# Altium schematic sheet rs485.SchDoc
size 330 x 190 mm; SheetNumber: 2; SheetTotal: 3
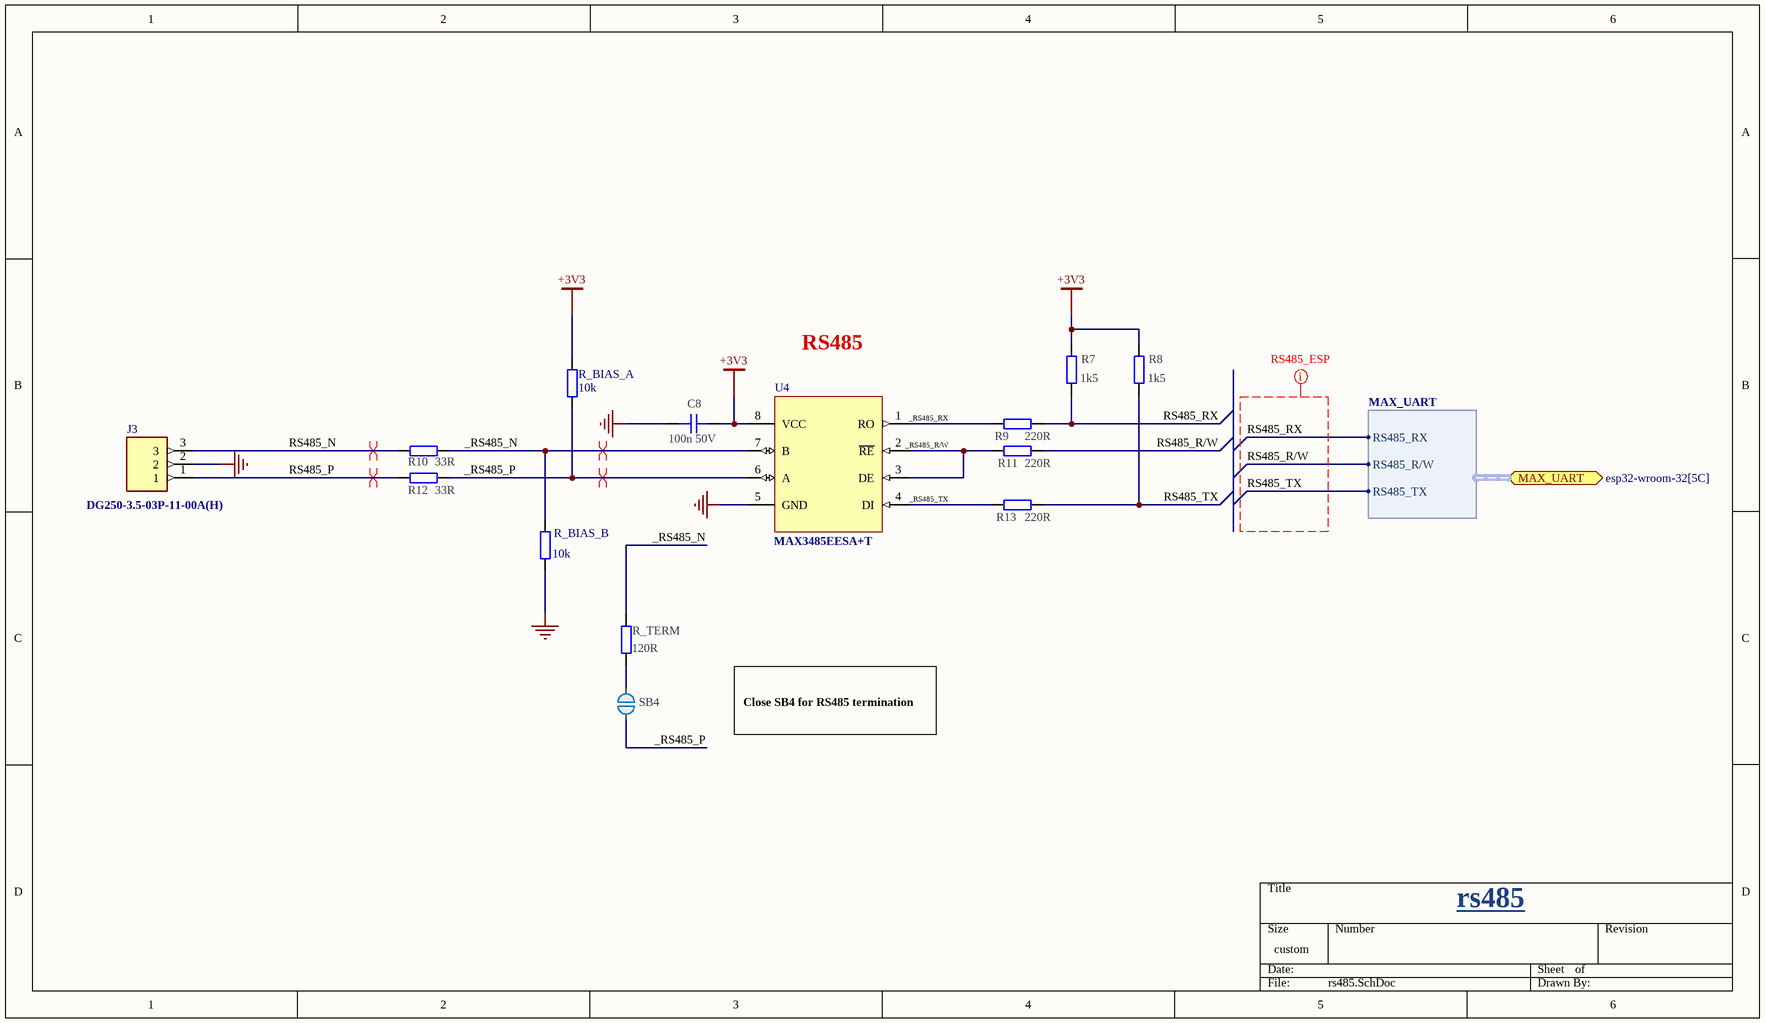
[diagram p0: rs485.SchDoc]

## Parts
C8  100n 50V  [CAPC1005X04L]
J3  DG250-3.5-03P-11-00A(H)  [DG250-3.5-03P-11-00AH]
R7  1k5  [RESC1005X04L]
R8  1k5  [RESC1005X04L]
R9  220R  [RESC1005X04L]
R10  33R  [RESC1005X04L]
R11  220R  [RESC1005X04L]
R12  33R  [RESC1005X04L]
R13  220R  [RESC1005X04L]
R_BIAS_A  10k  [RES_0603]
R_BIAS_B  10k  [RES_0603]
R_TERM  120R  [RESC1005X04L]
SB4  Solderbridge  [Solderbridge]  (value not drawn)  (no BOM)
U4  MAX3485EESA+T  [SOIC127P600X175-8N]

## Ports
MAX_UART (bidir, harness MAX_UART, see esp32-wroom-32[5C])

## Harnesses
MAX_UART: RS485_RX, RS485_R/W, RS485_TX

## Nets
+3V3: C8.2 R7.1 R8.1 R_BIAS_A.2 U4.8(VCC)
GND: C8.1 J3.2 R_BIAS_B.1 U4.5(GND)
_RS485_N: R10.2 R_BIAS_B.2 R_TERM.2 U4.7(B)
_RS485_P: R12.2 R_BIAS_A.1 SB4.2 U4.6(A)
_RS485_R/W: R11.1 U4.2(~{RE}) U4.3(DE)
_RS485_RX: R9.1 U4.1(RO)
_RS485_TX: R13.1 U4.4(DI)
RS485_N: J3.3 R10.1
RS485_P: J3.1 R12.1
RS485_R/W: R11.2 ; port MAX_UART.RS485_R/W
RS485_RX: R7.2 R9.2 ; port MAX_UART.RS485_RX
RS485_TX: R8.2 R13.2 ; port MAX_UART.RS485_TX
NetR_TERM_1: R_TERM.1 SB4.1

## Layout directives
differential pair: _RS485_N, _RS485_P, RS485_N, RS485_P
mark named RS485_ESP: RS485_R/W, RS485_RX, RS485_TX

## Notes on the sheet
- RS485
- Close SB4 for RS485 termination
- rs485

## Library data of the parts
C8 = C0402-4µ7: Capacitor, X5R, ±20%; Manufacturer: N.A.; Part number IPS: 00000001251, 00000007165; Part number NEMS: 100200193; Value: 4.7µF; Note: 10V; Artikkelnr Noca: 20039482; Pad Count: 2; Component Status: Active; Part Number: C0402-4µ7; Manufacturer Part Number: N.A.; ComponentLink1URL: N.A.; ComponentLink1Description: Datasheet; ComponentLink2URL: N.A.; ComponentLink2Description: Supplier link; HelpURL: N.A.; Footprint Doc: 0402; LatestRevisionDate: 2017-11-09; Published: 2009-05-08; Supplier 1: Digi-Key; Supplier Part Number 1: 490-13252-1-ND; Supplier 2: N.A.; Supplier Part Number 2: N.A.; PartId: 100200193; Component Class: Capacitors; Author: rsk; Part number Norautron: N.A.
J3 = DG250-3.5-03P-11-00A(H): Terminal block; 3.5mm; with push button; angled 45Â°; ways: 3; 5A; MF: Degson; SnapEDA_Link: https://www.snapeda.com/parts/DG250-3.5-03P-11-00A(H)/Degson/view-part/?ref=snap; Package: None; Value: *; MP: DG250-3.5-03P-11-00A(H); Check_prices: https://www.snapeda.com/parts/DG250-3.5-03P-11-00A(H)/Degson/view-part/?ref=eda
R7-R13 R_TERM = R0402-0R: Resistor, ±5%, 0.063W; Manufacturer: N.A.; Part number IPS: 00000007128; Part number NEMS: 100100109; Value: 0R; Note: Chip Res 5%; Artikkelnr Noca: 27049000; Pad Count: 2; Component Status: Active; Part Number: R0402-0R; Manufacturer Part Number: N.A.; ComponentLink1URL: N.A.; ComponentLink1Description: Datasheet; ComponentLink2URL: N.A.; ComponentLink2Description: Supplier link; HelpURL: N.A.; Footprint Doc: 0402; LatestRevisionDate: 2009-11-23; Published: 2009-05-08; Supplier 1: Farnell; Supplier Part Number 1: 146-9661; Supplier 2: N.A.; Supplier Part Number 2: N.A.; PartId: 100100109; Component Class: Resistors; Author: rsk; Part number Norautron: N.A.
R_BIAS_A R_BIAS_B = RES_0603: Resistor SMD 0603; Manufacturer: *; Manufacturer Part Number: *; Distributor Link: *; LCSC: *
SB4 = Solderbridge: Manufacturer: N.A.; Part number NEMS: 100500458; Pad Count: 2; Component Status: Active; System: Connector; Part Number: Solderbridge; Manufacturer Part Number: N.A.; LatestRevisionDate: 2009-12-14; Published: 2009-12-14; Value: Solderbridge; Note: N.A.; Artikkelnr Noca: N.A.; Footprint Doc: Solderbridge; Part number IPS: N.A.; ComponentLink1URL: N.A.; ComponentLink1Description: Datasheet; ComponentLink2URL: N.A.; ComponentLink2Description: Supplier link; HelpURL: N.A.; Supplier 1: N.A.; Supplier Part Number 1: N.A.; Supplier 2: N.A.; Supplier Part Number 2: N.A.; PartId: 100500458; Component Class: Connectors; Author: rsk; Part number Norautron: N.A.
U4 = MAX3485EESA+T: 3.3V Powered, Â±15kV ESD-Protected, 12Mbps, Slew-Rate-Limited True RS-485/RS-422 Transceivers3.3V ä¾›ç”µã€Â±15kV ESD ä¿æŠ¤ã€12Mbpsã€åŽ‹æ‘†çŽ‡å—é™çš„çœŸæ­£ RS-485/RS-422 æ”¶å‘å™¨; MF: Analog Devices; SnapEDA_Link: https://www.snapeda.com/parts/MAX3485EESA+T/Analog+Devices/view-part/?ref=snap; Package: SOIC-8 Maxim; Value: *; MP: MAX3485EESA+T; Check_prices: https://www.snapeda.com/parts/MAX3485EESA+T/Analog+Devices/view-part/?ref=eda